# EAGLE design businesscard (EAGLE 9.2.1)
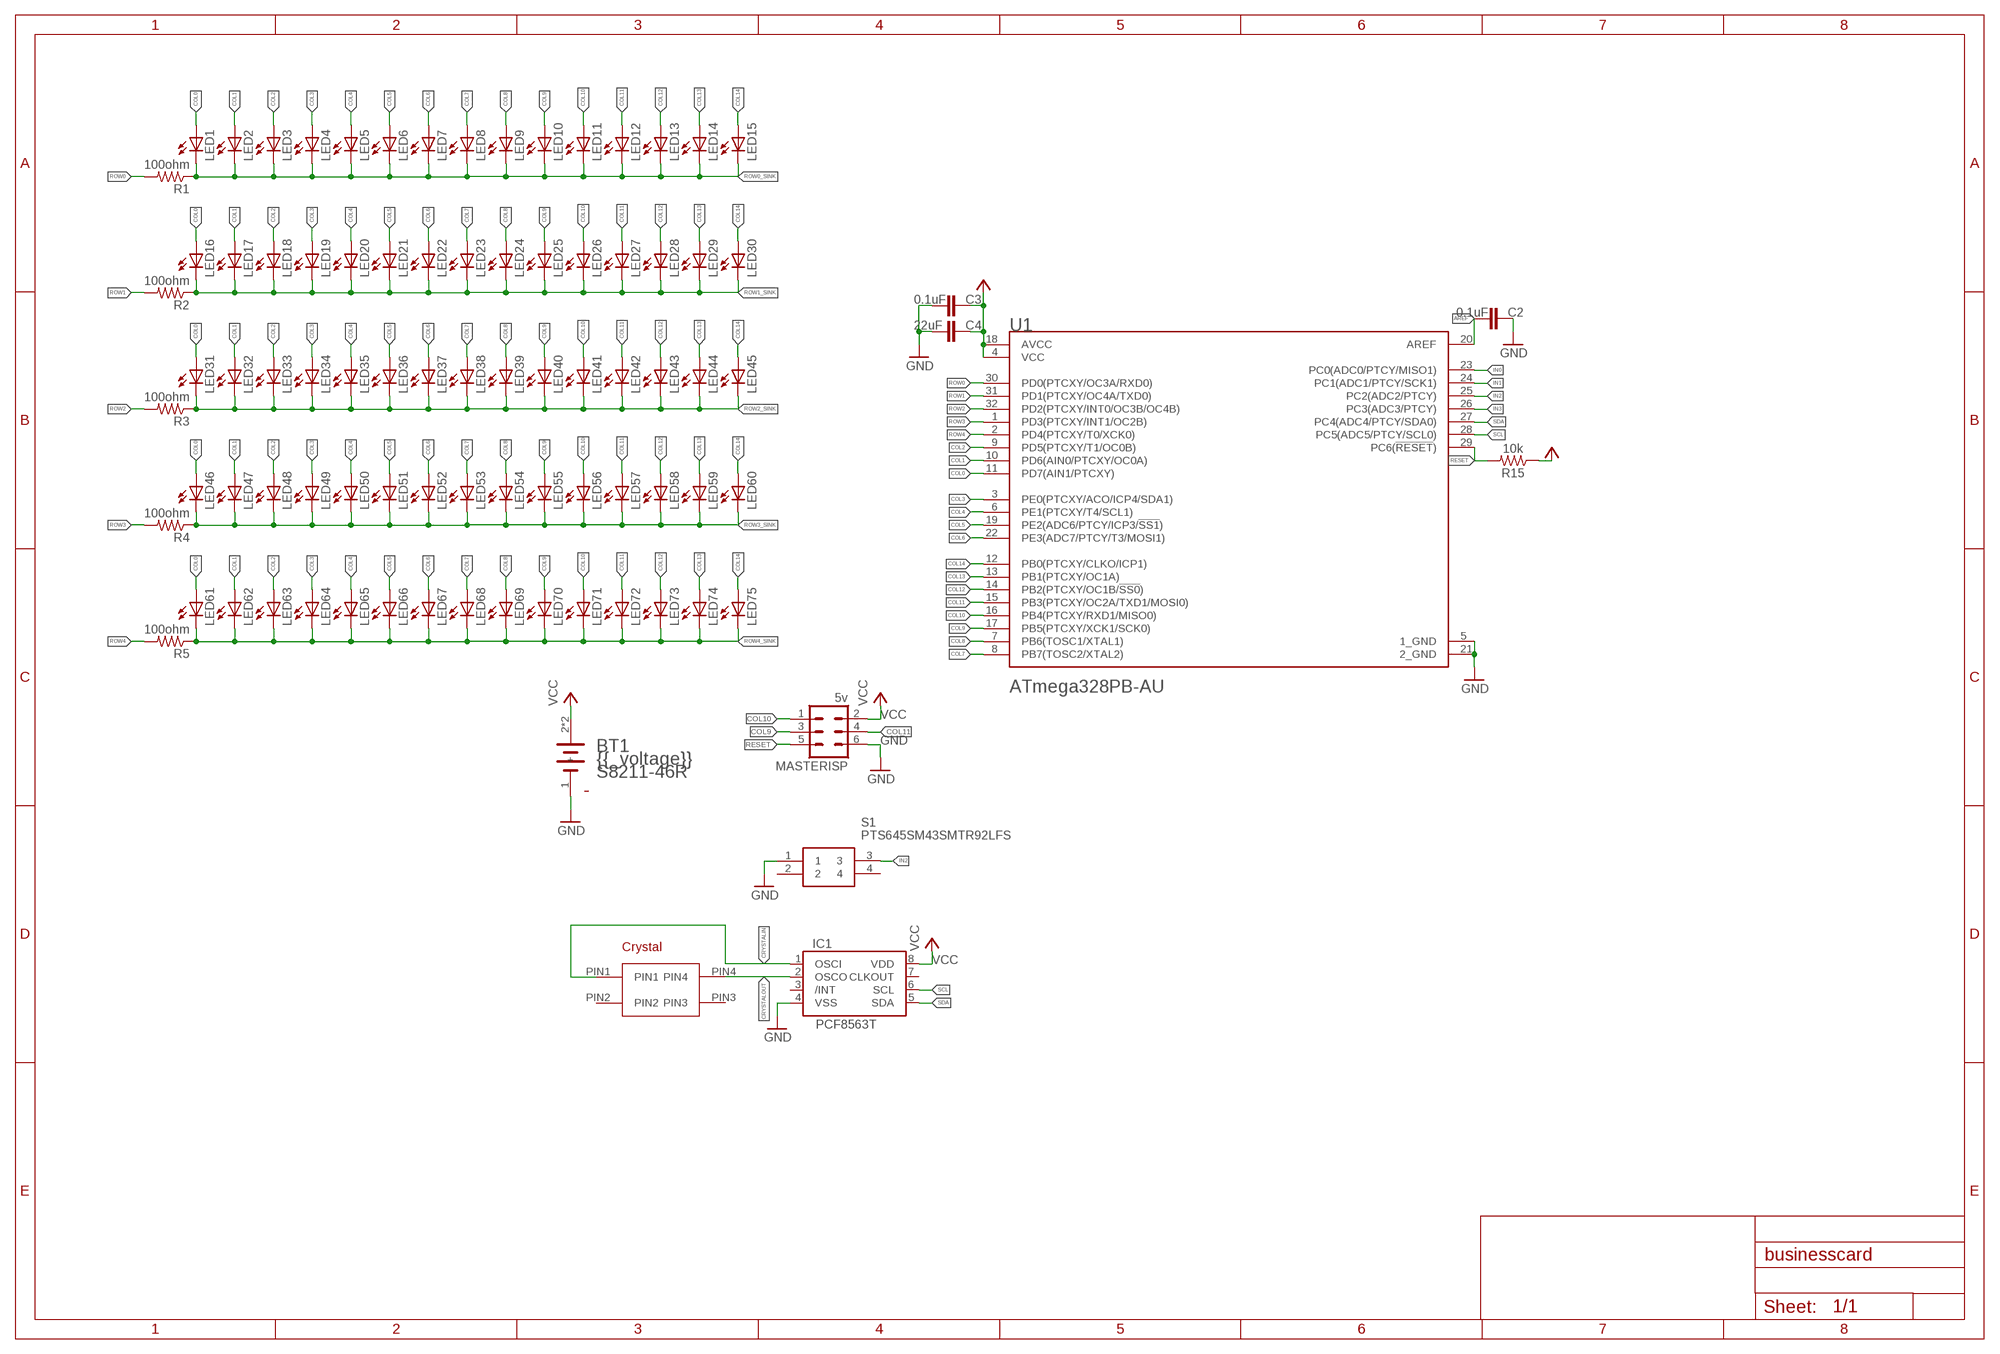
[diagram p0: schematic, sheet 1]

## Parts
BT1  3v  HARWIN_S8211-46RHARWIN_S8211-46R_0_0  [HARWIN_S8211-46R_0]
C2  0.1uF  C-EUC0603  [C0603]
C3  0.1uF  0.1UF-0603-25V-(+80/-20%)  [0603]
C4  22uF  C-EUC0603  [C0603]
IC1  PCF8563T  [SO8]
LED1  LEDCHIPLED_0805  [CHIPLED_0805]
LED2  LEDCHIPLED_0805  [CHIPLED_0805]
LED3  LEDCHIPLED_0805  [CHIPLED_0805]
LED4  LEDCHIPLED_0805  [CHIPLED_0805]
LED5  LEDCHIPLED_0805  [CHIPLED_0805]
LED6  LEDCHIPLED_0805  [CHIPLED_0805]
LED7  LEDCHIPLED_0805  [CHIPLED_0805]
LED8  LEDCHIPLED_0805  [CHIPLED_0805]
LED9  LEDCHIPLED_0805  [CHIPLED_0805]
LED10  LEDCHIPLED_0805  [CHIPLED_0805]
LED11  LEDCHIPLED_0805  [CHIPLED_0805]
LED12  LEDCHIPLED_0805  [CHIPLED_0805]
LED13  LEDCHIPLED_0805  [CHIPLED_0805]
LED14  LEDCHIPLED_0805  [CHIPLED_0805]
LED15  LEDCHIPLED_0805  [CHIPLED_0805]
LED16  LEDCHIPLED_0805  [CHIPLED_0805]
LED17  LEDCHIPLED_0805  [CHIPLED_0805]
LED18  LEDCHIPLED_0805  [CHIPLED_0805]
LED19  LEDCHIPLED_0805  [CHIPLED_0805]
LED20  LEDCHIPLED_0805  [CHIPLED_0805]
LED21  LEDCHIPLED_0805  [CHIPLED_0805]
LED22  LEDCHIPLED_0805  [CHIPLED_0805]
LED23  LEDCHIPLED_0805  [CHIPLED_0805]
LED24  LEDCHIPLED_0805  [CHIPLED_0805]
LED25  LEDCHIPLED_0805  [CHIPLED_0805]
LED26  LEDCHIPLED_0805  [CHIPLED_0805]
LED27  LEDCHIPLED_0805  [CHIPLED_0805]
LED28  LEDCHIPLED_0805  [CHIPLED_0805]
LED29  LEDCHIPLED_0805  [CHIPLED_0805]
LED30  LEDCHIPLED_0805  [CHIPLED_0805]
LED31  LEDCHIPLED_0805  [CHIPLED_0805]
LED32  LEDCHIPLED_0805  [CHIPLED_0805]
LED33  LEDCHIPLED_0805  [CHIPLED_0805]
LED34  LEDCHIPLED_0805  [CHIPLED_0805]
LED35  LEDCHIPLED_0805  [CHIPLED_0805]
LED36  LEDCHIPLED_0805  [CHIPLED_0805]
LED37  LEDCHIPLED_0805  [CHIPLED_0805]
LED38  LEDCHIPLED_0805  [CHIPLED_0805]
LED39  LEDCHIPLED_0805  [CHIPLED_0805]
LED40  LEDCHIPLED_0805  [CHIPLED_0805]
LED41  LEDCHIPLED_0805  [CHIPLED_0805]
LED42  LEDCHIPLED_0805  [CHIPLED_0805]
LED43  LEDCHIPLED_0805  [CHIPLED_0805]
LED44  LEDCHIPLED_0805  [CHIPLED_0805]
LED45  LEDCHIPLED_0805  [CHIPLED_0805]
LED46  LEDCHIPLED_0805  [CHIPLED_0805]
LED47  LEDCHIPLED_0805  [CHIPLED_0805]
LED48  LEDCHIPLED_0805  [CHIPLED_0805]
LED49  LEDCHIPLED_0805  [CHIPLED_0805]
LED50  LEDCHIPLED_0805  [CHIPLED_0805]
LED51  LEDCHIPLED_0805  [CHIPLED_0805]
LED52  LEDCHIPLED_0805  [CHIPLED_0805]
LED53  LEDCHIPLED_0805  [CHIPLED_0805]
LED54  LEDCHIPLED_0805  [CHIPLED_0805]
LED55  LEDCHIPLED_0805  [CHIPLED_0805]
LED56  LEDCHIPLED_0805  [CHIPLED_0805]
LED57  LEDCHIPLED_0805  [CHIPLED_0805]
LED58  LEDCHIPLED_0805  [CHIPLED_0805]
LED59  LEDCHIPLED_0805  [CHIPLED_0805]
LED60  LEDCHIPLED_0805  [CHIPLED_0805]
LED61  LEDCHIPLED_0805  [CHIPLED_0805]
LED62  LEDCHIPLED_0805  [CHIPLED_0805]
LED63  LEDCHIPLED_0805  [CHIPLED_0805]
LED64  LEDCHIPLED_0805  [CHIPLED_0805]
LED65  LEDCHIPLED_0805  [CHIPLED_0805]
LED66  LEDCHIPLED_0805  [CHIPLED_0805]
LED67  LEDCHIPLED_0805  [CHIPLED_0805]
LED68  LEDCHIPLED_0805  [CHIPLED_0805]
LED69  LEDCHIPLED_0805  [CHIPLED_0805]
LED70  LEDCHIPLED_0805  [CHIPLED_0805]
LED71  LEDCHIPLED_0805  [CHIPLED_0805]
LED72  LEDCHIPLED_0805  [CHIPLED_0805]
LED73  LEDCHIPLED_0805  [CHIPLED_0805]
LED74  LEDCHIPLED_0805  [CHIPLED_0805]
LED75  LEDCHIPLED_0805  [CHIPLED_0805]
MASTERISP  5v  MA03-2  [MA03-2]
R1  100ohm  R-US_R0603  [R0603]
R2  100ohm  R-US_R0603  [R0603]
R3  100ohm  R-US_R0603  [R0603]
R4  100ohm  R-US_R0603  [R0603]
R5  100ohm  R-US_R0603  [R0603]
R15  10k  10KOHM-0603-1/10W-1%  [0603]
S1  PTS645SM43SMTR92LFS  [PTS645(SMT)]
U1  MICROCHIP_ATMEGA328PB-AUMICROCHIP_ATMEGA328PB-AU_0_0  [MICROCHIP_ATMEGA328PB-AU_0]
U$1  32.768_SMD_CRYSTAL  [32.768_SMD_CRYSTAL]

## Nets
AREF: C2.2 U1.20(AREF)
COL0: LED1.A LED16.A LED31.A LED46.A LED61.A U1.11(PD7(AIN1/PTCXY))
COL1: LED2.A LED17.A LED32.A LED47.A LED62.A U1.10(PD6(AIN0/PTCXY/OC0A))
COL2: LED3.A LED18.A LED33.A LED48.A LED63.A U1.9(PD5(PTCXY/T1/OC0B))
COL3: LED4.A LED19.A LED34.A LED49.A LED64.A U1.3(PE0(PTCXY/ACO/ICP4/SDA1))
COL4: LED5.A LED20.A LED35.A LED50.A LED65.A U1.6(PE1(PTCXY/T4/SCL1))
COL5: LED6.A LED21.A LED36.A LED51.A LED66.A U1.19(PE2(ADC6/PTCY/ICP3/!SS1!))
COL6: LED7.A LED22.A LED37.A LED52.A LED67.A U1.22(PE3(ADC7/PTCY/T3/MOSI1))
COL7: LED8.A LED23.A LED38.A LED53.A LED68.A U1.8(PB7(TOSC2/XTAL2))
COL8: LED9.A LED24.A LED39.A LED54.A LED69.A U1.7(PB6(TOSC1/XTAL1))
COL9: LED10.A LED25.A LED40.A LED55.A LED70.A MASTERISP.3 U1.17(PB5(PTCXY/XCK1/SCK0))
COL10: LED11.A LED26.A LED41.A LED56.A LED71.A MASTERISP.1 U1.16(PB4(PTCXY/RXD1/MISO0))
COL11: LED12.A LED27.A LED42.A LED57.A LED72.A MASTERISP.4 U1.15(PB3(PTCXY/OC2A/TXD1/MOSI0))
COL12: LED13.A LED28.A LED43.A LED58.A LED73.A U1.14(PB2(PTCXY/OC1B/!SS0!))
COL13: LED14.A LED29.A LED44.A LED59.A LED74.A U1.13(PB1(PTCXY/OC1A))
COL14: LED15.A LED30.A LED45.A LED60.A LED75.A U1.12(PB0(PTCXY/CLKO/ICP1))
CRYSTALIN: IC1.1(OSCI) U$1.PIN1
CRYSTALOUT: IC1.2(OSCO) U$1.PIN4
GND: BT1.1(-) C2.1 C3.2 C4.2 IC1.4(VSS) MASTERISP.6 S1.1 U1.5(1_GND) U1.21(2_GND)
IN0: U1.23(PC0(ADC0/PTCY/MISO1))
IN1: U1.24(PC1(ADC1/PTCY/SCK1))
IN2: S1.3 U1.25(PC2(ADC2/PTCY))
IN3: U1.26(PC3(ADC3/PTCY))
RESET: MASTERISP.5 R15.2 U1.29(PC6(!RESET!))
ROW0: R1.2 U1.30(PD0(PTCXY/OC3A/RXD0))
ROW0_SINK: LED1.C LED2.C LED3.C LED4.C LED5.C LED6.C LED7.C LED8.C LED9.C LED10.C LED11.C LED12.C LED13.C LED14.C LED15.C R1.1
ROW1: R2.2 U1.31(PD1(PTCXY/OC4A/TXD0))
ROW1_SINK: LED16.C LED17.C LED18.C LED19.C LED20.C LED21.C LED22.C LED23.C LED24.C LED25.C LED26.C LED27.C LED28.C LED29.C LED30.C R2.1
ROW2: R3.2 U1.32(PD2(PTCXY/INT0/OC3B/OC4B))
ROW2_SINK: LED31.C LED32.C LED33.C LED34.C LED35.C LED36.C LED37.C LED38.C LED39.C LED40.C LED41.C LED42.C LED43.C LED44.C LED45.C R3.1
ROW3: R4.2 U1.1(PD3(PTCXY/INT1/OC2B))
ROW3_SINK: LED46.C LED47.C LED48.C LED49.C LED50.C LED51.C LED52.C LED53.C LED54.C LED55.C LED56.C LED57.C LED58.C LED59.C LED60.C R4.1
ROW4: R5.2 U1.2(PD4(PTCXY/T0/XCK0))
ROW4_SINK: LED61.C LED62.C LED63.C LED64.C LED65.C LED66.C LED67.C LED68.C LED69.C LED70.C LED71.C LED72.C LED73.C LED74.C LED75.C R5.1
SCL: IC1.6(SCL) U1.28(PC5(ADC5/PTCY/SCL0))
SDA: IC1.5(SDA) U1.27(PC4(ADC4/PTCY/SDA0))
VCC: BT1.2(+) BT1.2-2(+) C3.1 C4.1 IC1.8(VDD) MASTERISP.2 R15.1 U1.4(VCC) U1.18(AVCC)
Unconnected: IC1.3(/INT) IC1.7(CLKOUT) S1.2 S1.4 U$1.PIN2 U$1.PIN3

## Library data of the parts
BT1 = Harwin - S8211-46R:HARWIN_S8211-46R: HOLDER BATT COIN CR2032/20MM; CENTROID_NOT_SPECIFIED: No; DATASHEET: https://cdn.harwin.com/pdfs/S8211R.pdf; DIGIKEY_DESCRIPTION: BATT HOLDER BATT COIN CR2032/20MM; DIGIKEY_PART_NUMBER: 952-1735-1-ND; LEAD_FREE: yes; MF: Harwin; MOUSER_PART_NUMBER: 855-S8211-46R; MPN: S8211-46R; PACKAGE: BAT_HOLDER_SMT; PREFIX: BT; ROHS: yes; TEMPERATURE_RANGE_HIGH: +105°C; TEMPERATURE_RANGE_LOW: -40°C
C2 C4 = rcl:C-EU: CAPACITOR, European symbol; SPICEPREFIX: C
C3 = SparkFun-Capacitors:0.1UF: 0.1µF ceramic capacitors A capacitor is a passive two-terminal electrical component used to store electrical energy temporarily in an electric field.; PROD_ID: CAP-00810
IC1 = PCF8563T:PCF8563
LED1-LED75 = adafruit:LED: LED OSRAM: - CHIPLED LG R971, LG N971, LY N971, LG Q971, LY Q971, LO R971, LY R971 LH N974, LH R974 LS Q976, LO Q976, LY Q976 LO Q996 - Hyper CHIPLED LW Q18S LB Q993, LB Q99A, LB R99A - SideLED LS A670, LO A670, LY A670, LG A670, LP A670 LB A673, LV A673, LT A673, LW A673 LH A674 LY A675 LS A676, LA A676, LO A676, LY A676, LW A676 LS A679, LY A679, LG A679 - Hyper Micro SIDELED® LS Y876, LA Y876, LO Y876, LY Y876 LT Y87S - SmartLED LW L88C, LW L88S LB L89C, LB L89S, LG L890 LS L89K, LO L89K, LY L89K LS L896, LA L896, LO L896, LY L896 - TOPLED LS T670, LO T670, LY T670, LG T670, LP T670 LSG T670, LSP T670, LSY T670, LOP T670, LYG T670 LG T671, LOG T671, LSG T671 LB T673, LV T673, LT T673, LW T673 LH T674 LS T676, LA T676, LO T676, LY T676, LB T676, LH T676, LSB T676, LW T676 LB T67C, LV T67C, LT T67C, LS T67K, LO T67K, LY T67K, LW E67C LS E67B, LA E67B, LO E67B, LY E67B, LB E67C, LV E67C, LT E67C LW T67C LS T679, LY T679, LG T679 LS T770, LO T770, LY T770, LG T770, LP T770 LB T773, LV T773, LT T773, LW T773 LH T774 LS E675, LA E675, LY E675, LS T675 LS T776, LA T776, LO T776, LY T776, LB T776 LHGB T686 LT T68C, LB T68C - Hyper Mini TOPLED® LB M676 - Mini TOPLED Santana® LG M470 LS M47K, LO M47K, LY M47K Source: http://www.osram.convergy.de/
MASTERISP = con-lstb:MA03-2: PIN HEADER; OC_FARNELL: unknown; OC_NEWARK: unknown
R1-R5 = adafruit:R-US_: RESISTOR, American symbol
R15 = SparkFun-Resistors:10KOHM: 10kΩ resistor A resistor is a passive two-terminal electrical component that implements electrical resistance as a circuit element. Resistors act to reduce current flow, and, at the same time, act to lower voltage levels within circuits. - Wikipedia; PROD_ID: RES-00824
S1 = PTS645SM43SMTR92LFS:PTS645SM43SMTR92LFS: C & K COMPONENTS - PTS645SM43SMTR92LFS - SWITCH, SPST, 0.05A, 12VDC, SMD, 4.3MM Source: Datasheet <http://www.farnell.com/datasheets/1914518.pdf>; DESCRIPTION: C & K COMPONENTS - PTS645SM43SMTR92LFS - SWITCH, SPST, 0.05A, 12VDC, SMD, 4.3MM; HEIGHT: mm; MANUFACTURER_NAME: C & K COMPONENTS; MANUFACTURER_PART_NUMBER: PTS645SM43SMTR92LFS; MOUSER_PART_NUMBER: 611-PTS645SM43SMTR92; MOUSER_PRICE-STOCK: https://www.mouser.com/Search/Refine.aspx?Keyword=611-PTS645SM43SMTR92
U1 = Microchip - ATmega328PB-AU:MICROCHIP_ATMEGA328PB-AU: ATmega328PB Summary Datasheet; CENTROID_NOT_SPECIFIED: No; DATASHEET: http://ww1.microchip.com/downloads/en/DeviceDoc/40001907A.pdf; DIGIKEY_DESCRIPTION: IC MCU 8BIT 32KB FLASH 32TQFP; DIGIKEY_PART_NUMBER: ATMEGA328PB-AU-ND; LEAD_FREE: yes; MF: Microchip; MFG_PACKAGE_IDENT: 32A; MOUSER_PART_NUMBER: 556-ATMEGA328PB-AU; MPN: ATmega328PB-AU; PACKAGE: TQFP32; PREFIX: U; ROHS: yes; TEMPERATURE_RANGE_HIGH: +85°C; TEMPERATURE_RANGE_LOW: -40°C; VOLTAGE: 5.5V
U$1 = 32.768-crystal:32.768_SMD_CRYSTAL

## Board
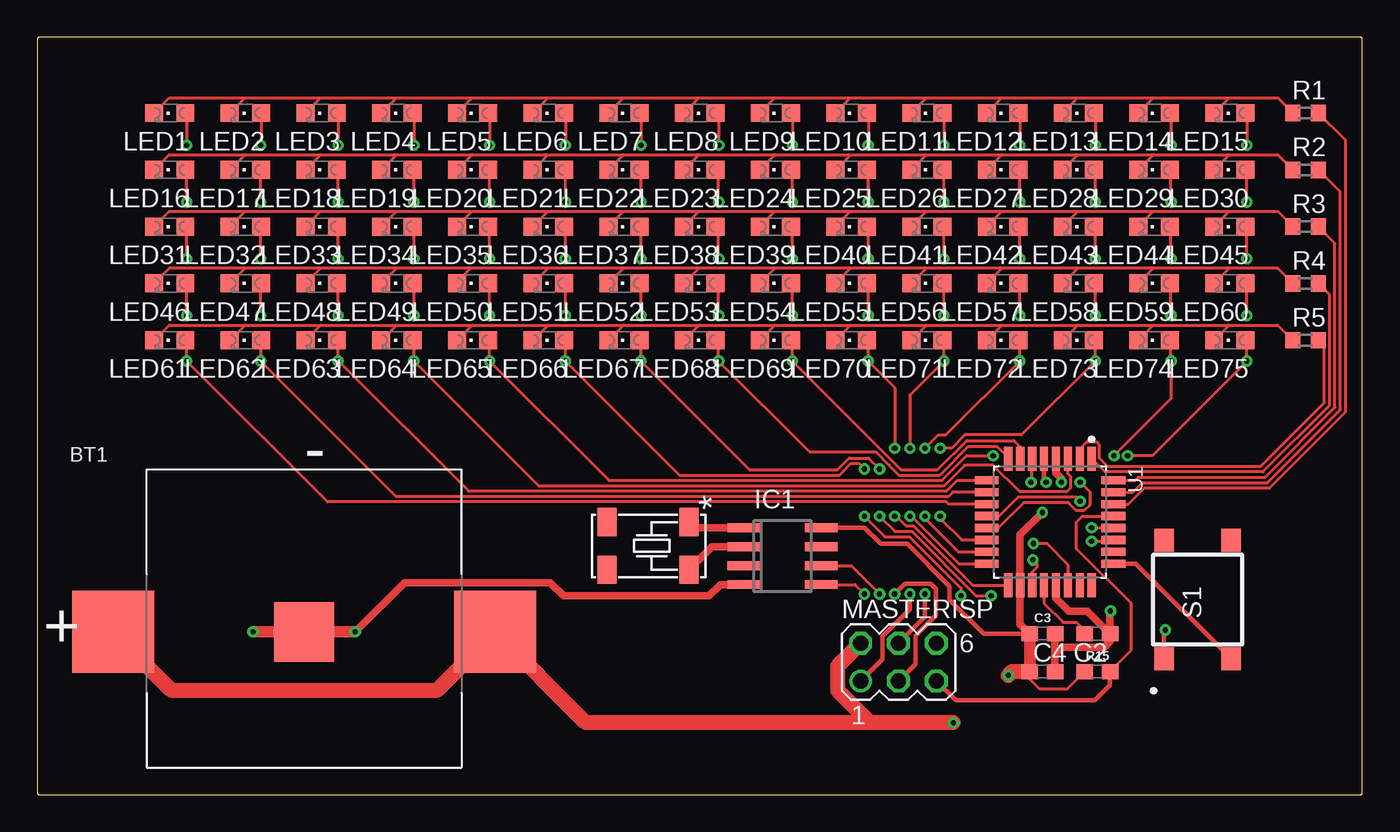
[diagram p1: board, top side]
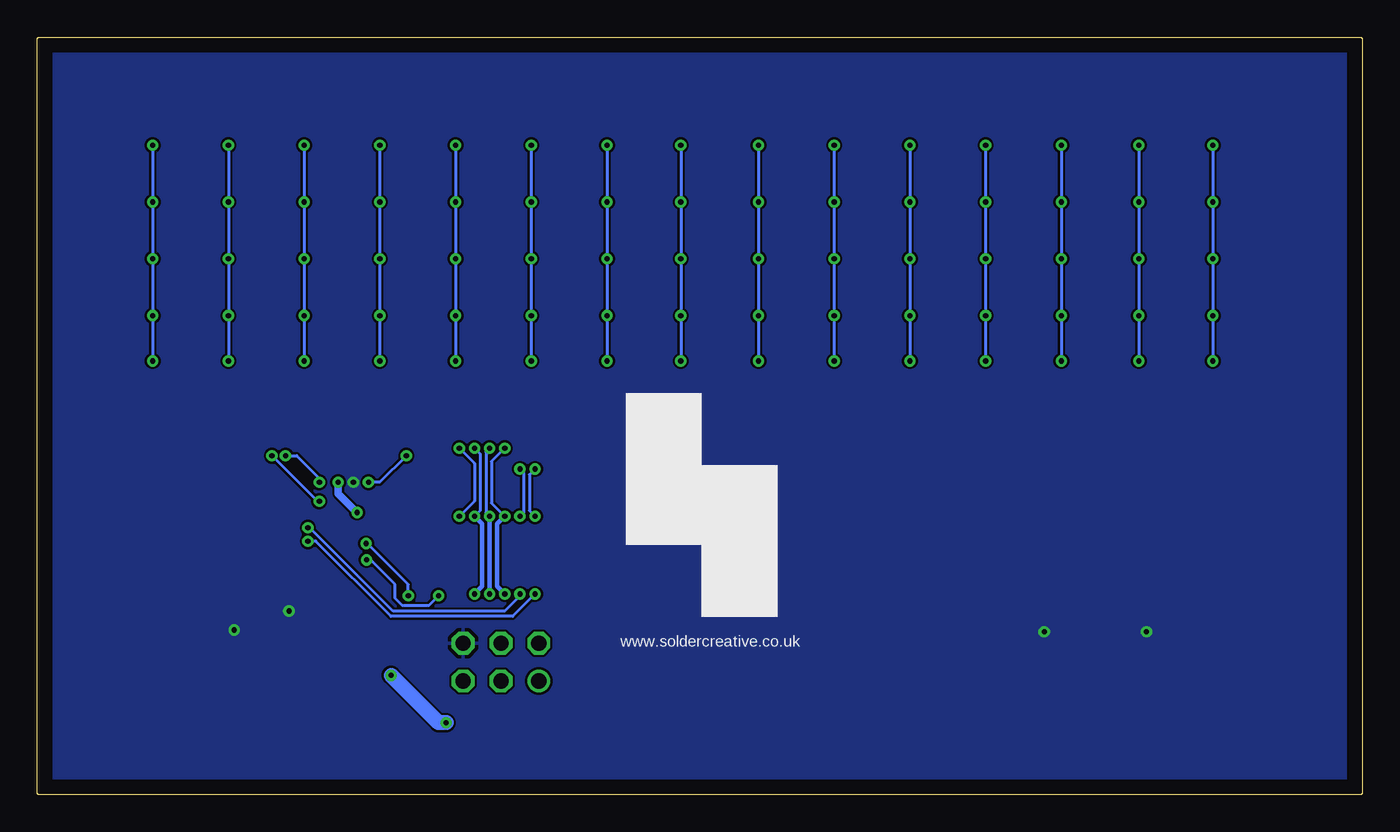
[diagram p2: board, bottom side, seen from below]

Size 88.9 x 50.8 mm. Coordinates in mm from the lower left corner, seen from the top.
Outline: 0,50.67 0,0.13 arc90 0.13,0 88.77,0 arc90 88.9,0.13 88.9,50.67 arc90 88.77,50.8 0.13,50.8 arc90 0,50.67
Copper layers (1*16): Top 0.035mm / dielectric 1.5mm / Bottom 0.035mm
Design rules "default": minimum track width 6mil, minimum drill 0.35mm, track to track 6mil, track to pad 6mil, pad to pad 6mil, via to via 6mil, smd to smd 6mil, copper to edge 40mil, drill to drill 6mil, minimum pad ring 10mil, minimum via ring 8mil, stop-mask expansion 4mil, vias tented up to drill 0mil, thermal gap 10mil

### Footprints (pad centres in the part's own frame; a part is rotated, then mirrored left to right if it is on the bottom)
HARWIN_S8211-46R_0 = smd 4 x 4: 1 0,-0.9 | smd 5.5 x 5.5: 2 -12.8,-0.9; 2-2 12.8,-0.9
C0603 = smd 1.1 x 1: 1 -0.85,0; 2 0.85,0
0603 = smd 1.1 x 1: 1 -0.85,0; 2 0.85,0
SO8 = smd 0.6 x 2.2: 1 -1.905,-2.6; 2 -0.635,-2.6; 3 0.635,-2.6; 4 1.905,-2.6; 5 1.905,2.6; 6 0.635,2.6; 7 -0.635,2.6; 8 -1.905,2.6
CHIPLED_0805 = smd 1.2 x 1.2: A 0,-1.05; C 0,1.05
MA03-2 = drill 1.016: 1 -2.54,-1.27 | drill 1.016 octagon: 2 -2.54,1.27; 3 0,-1.27; 4 0,1.27; 5 2.54,-1.27; 6 2.54,1.27
R0603 = smd 1 x 1.1: 1 -0.85,0; 2 0.85,0
PTS645(SMT) = smd 1.55 x 1.3: 1 -3.975,2.25; 2 3.975,2.25; 3 -3.975,-2.25; 4 3.975,-2.25
MICROCHIP_ATMEGA328PB-AU_0 = smd 1.6 x 0.55: 1 -4.25,2.8; 2 -4.25,2; 3 -4.25,1.2; 4 -4.25,0.4; 5 -4.25,-0.4; 6 -4.25,-1.2; 7 -4.25,-2; 8 -4.25,-2.8; 17 4.25,-2.8; 18 4.25,-2; 19 4.25,-1.2; 20 4.25,-0.4; 21 4.25,0.4; 22 4.25,1.2; 23 4.25,2; 24 4.25,2.8 | smd 0.55 x 1.6: 9 -2.8,-4.25; 10 -2,-4.25; 11 -1.2,-4.25; 12 -0.4,-4.25; 13 0.4,-4.25; 14 1.2,-4.25; 15 2,-4.25; 16 2.8,-4.25; 25 2.8,4.25; 26 2,4.25; 27 1.2,4.25; 28 0.4,4.25; 29 -0.4,4.25; 30 -1.2,4.25; 31 -2,4.25; 32 -2.8,4.25
32.768_SMD_CRYSTAL = smd 1.9 x 1.3: PIN1 0,5.5; PIN2 0,0; PIN3 3.2,0; PIN4 3.2,5.5

### Placement (x,y rotation side)
BT1  17.91,11.81 0 top
C2  71.12,10.79 180 top
C3  67.44,10.79 0 top
C4  67.44,8.26 0 top
IC1  50,16 270 top
LED1  8.89,45.72 90 top
LED2  13.97,45.72 90 top
LED3  19.05,45.72 90 top
LED4  24.13,45.72 90 top
LED5  29.21,45.72 90 top
LED6  34.29,45.72 90 top
LED7  39.37,45.72 90 top
LED8  44.45,45.72 90 top
LED9  49.53,45.72 90 top
LED10  54.61,45.72 90 top
LED11  59.69,45.72 90 top
LED12  64.77,45.72 90 top
LED13  69.85,45.72 90 top
LED14  74.93,45.72 90 top
LED15  80.01,45.72 90 top
LED16  8.89,41.91 90 top
LED17  13.97,41.91 90 top
LED18  19.05,41.91 90 top
LED19  24.13,41.91 90 top
LED20  29.21,41.91 90 top
LED21  34.29,41.91 90 top
LED22  39.37,41.91 90 top
LED23  44.45,41.91 90 top
LED24  49.53,41.91 90 top
LED25  54.61,41.91 90 top
LED26  59.69,41.91 90 top
LED27  64.77,41.91 90 top
LED28  69.85,41.91 90 top
LED29  74.93,41.91 90 top
LED30  80.01,41.91 90 top
LED31  8.89,38.1 90 top
LED32  13.97,38.1 90 top
LED33  19.05,38.1 90 top
LED34  24.13,38.1 90 top
LED35  29.21,38.1 90 top
LED36  34.29,38.1 90 top
LED37  39.37,38.1 90 top
LED38  44.45,38.1 90 top
LED39  49.53,38.1 90 top
LED40  54.61,38.1 90 top
LED41  59.69,38.1 90 top
LED42  64.77,38.1 90 top
LED43  69.85,38.1 90 top
LED44  74.93,38.1 90 top
LED45  80.01,38.1 90 top
LED46  8.89,34.29 90 top
LED47  13.97,34.29 90 top
LED48  19.05,34.29 90 top
LED49  24.13,34.29 90 top
LED50  29.21,34.29 90 top
LED51  34.29,34.29 90 top
LED52  39.37,34.29 90 top
LED53  44.45,34.29 90 top
LED54  49.53,34.29 90 top
LED55  54.61,34.29 90 top
LED56  59.69,34.29 90 top
LED57  64.77,34.29 90 top
LED58  69.85,34.29 90 top
LED59  74.93,34.29 90 top
LED60  80.01,34.29 90 top
LED61  8.89,30.48 90 top
LED62  13.97,30.48 90 top
LED63  19.05,30.48 90 top
LED64  24.13,30.48 90 top
LED65  29.21,30.48 90 top
LED66  34.29,30.48 90 top
LED67  39.37,30.48 90 top
LED68  44.45,30.48 90 top
LED69  49.53,30.48 90 top
LED70  54.61,30.48 90 top
LED71  59.69,30.48 90 top
LED72  64.77,30.48 90 top
LED73  69.85,30.48 90 top
LED74  74.93,30.48 90 top
LED75  80.01,30.48 90 top
MASTERISP  57.78,8.89 0 top
R1  85.09,45.72 0 top
R2  85.09,41.91 0 top
R3  85.09,38.1 0 top
R4  85.09,34.29 0 top
R5  85.09,30.48 0 top
R15  71.12,8.26 0 top
S1  77.85,13.08 90 top
U1  67.94,18.29 270 top
U$1  38.23,18.29 270 top

### Tracks (layer width: path | path; a pad name or v marks a point on that pad's centre or on a via)
AREF
  Top 0.203: U1.20 67.55,12.85 68.83,11.56 69.72,11.56 70.27,11.01 C2.2
COL0  (via drill 0.35)
  Top 0.203: LED1.A 10.03,45.63 v10.03,43.56 | v10.03,39.75 10.03,41.82 LED16.A | v10.03,35.94 10.03,38.01 LED31.A | v10.03,32.13 10.03,34.2 LED46.A | LED61.A 10.03,30.39 v10.03,29.08 19.48,19.63 61.01,19.63 61.16,19.49 U1.11
  Bottom 0.203: v10.03,43.56 v10.03,39.75 v10.03,35.94 v10.03,32.13 v10.03,29.08
COL1  (via drill 0.35)
  Top 0.203: LED2.A 15.02,43.59 v14.99,43.56 | v14.99,39.75 14.99,41.88 LED17.A | v14.99,35.94 14.99,38.07 LED32.A | v14.99,32.13 14.99,34.26 LED47.A | LED62.A 15.02,29.12 v14.99,29.08 24.08,19.99 61.13,19.99 61.43,20.29 U1.10
  Bottom 0.203: v14.99,43.56 v14.99,39.75 v14.99,35.94 v14.99,32.13 v14.99,29.08
COL2  (via drill 0.35)
  Top 0.203: LED3.A 20.19,45.63 v20.19,43.56 | v20.19,39.75 20.19,41.82 LED18.A | v20.19,35.94 20.19,38.01 LED33.A | v20.19,32.13 20.19,34.2 LED48.A | LED63.A 20.19,30.39 v20.19,29.08 20.23,29.08 28.97,20.34 60.98,20.34 61.72,21.08 U1.9
  Bottom 0.203: v20.19,43.56 v20.19,39.75 v20.19,35.94 v20.19,32.13 v20.19,29.08
COL3  (via drill 0.35)
  Top 0.203: LED4.A 25.27,45.63 v25.27,43.56 | v25.27,39.75 25.27,41.82 LED19.A | v25.27,35.94 25.27,38.01 LED34.A | v25.27,32.13 25.27,34.2 LED49.A | LED64.A 25.27,30.39 v25.27,29.08 33.66,20.7 60.83,20.7 62.23,22.1 64.14,22.1 65.91,20.32 69.09,20.32 69.34,20.57 69.34,21.34 69.14,21.53 U1.3
  Bottom 0.203: v25.27,43.56 v25.27,39.75 v25.27,35.94 v25.27,32.13 v25.27,29.08
COL4  (via drill 0.35)
  Top 0.203: LED5.A 30.35,45.63 v30.35,43.56 | v30.35,39.75 30.35,41.82 LED20.A | v30.35,35.94 30.35,38.01 LED35.A | v30.35,32.13 30.35,34.2 LED50.A | LED65.A 30.35,30.39 v30.35,29.08 38.35,21.08 60.71,21.08 62.36,22.73 v64.14,22.73 | v66.67,20.95 66.75,21.02 U1.6
  Bottom 0.203: v30.35,43.56 v30.35,39.75 v30.35,35.94 v30.35,32.13 v30.35,29.08 | v64.14,22.73 65.91,20.95 v66.67,20.95
COL5  (via drill 0.35)
  Top 0.203: LED6.A 35.43,45.63 v35.43,43.56 | v35.43,39.75 35.43,41.82 LED21.A | v35.43,35.94 35.43,38.01 LED36.A | v35.43,32.13 35.43,34.2 LED51.A | LED66.A 35.43,30.39 v35.43,29.08 43.08,21.44 53.82,21.44 54.61,22.23 55.12,22.23 v55.5,21.84 | v55.5,18.67 56.87,17.3 58.53,17.3 61.98,13.85 v61.98,13.34 | v66.8,15.75 67.06,15.49 67.06,15.24 66.75,14.93 U1.19
  Bottom 0.203: v35.43,43.56 v35.43,39.75 v35.43,35.94 v35.43,32.13 v35.43,29.08 | v55.5,21.84 55.88,21.46 55.88,19.05 v55.5,18.67 | v61.98,13.34 62.64,12.68 64.39,12.68 64.9,13.18 64.9,14.1 66.55,15.75 v66.8,15.75
COL6  (via drill 0.35)
  Top 0.203: LED7.A 40.51,45.63 v40.51,43.56 | v40.51,39.75 40.51,41.82 LED22.A | v40.51,35.94 40.51,38.01 LED37.A | v40.51,32.13 40.51,34.2 LED52.A | LED67.A 40.51,30.39 v40.51,29.08 47.8,21.79 53.67,21.79 54.46,22.58 55.78,22.58 v56.52,21.84 | v64.01,13.34 62.99,13.34 58.67,17.65 57.53,17.65 v56.52,18.67 | v66.84,16.85 67.73,16.85 69.14,15.44 U1.22
  Bottom 0.203: v40.51,43.56 v40.51,39.75 v40.51,35.94 v40.51,32.13 v40.51,29.08 | v56.52,21.84 56.26,21.59 56.26,18.92 v56.52,18.67 | v66.84,16.85 66.76,16.85 64.01,14.1 v64.01,13.34
COL7  (via drill 0.35)
  Top 0.203: LED8.A 45.72,45.5 v45.72,43.56 | v45.72,39.75 45.72,41.69 LED23.A | v45.72,35.94 45.72,37.88 LED38.A | v45.72,32.13 45.72,34.07 LED53.A | LED68.A 45.72,30.26 v45.72,29.08 51.82,22.99 56.27,22.99 57.15,22.11 57.15,22.1 57.81,21.44 60.56,21.44 62.49,23.36 64.4,23.36 65.14,22.62 U1.8
  Bottom 0.203: v45.72,43.56 v45.72,39.75 v45.72,35.94 v45.72,32.13 v45.72,29.08
COL8  (via drill 0.35)
  Top 0.203: LED9.A 50.67,45.63 v50.67,43.56 | v50.67,39.75 50.67,41.82 LED24.A | v50.67,35.94 50.67,38.01 LED39.A | v50.67,32.13 50.67,34.2 LED54.A | LED69.A 50.67,30.39 v50.67,29.08 57.96,21.79 60.41,21.79 62.37,23.75 65.53,23.75 65.94,23.34 U1.7
  Bottom 0.203: v50.67,43.56 v50.67,39.75 v50.67,35.94 v50.67,32.13 v50.67,29.08
COL9  (via drill 0.35)
  Top 0.203: LED10.A 55.75,45.63 v55.75,43.56 | v55.75,39.75 55.75,41.82 LED25.A | v55.75,35.94 55.75,38.01 LED40.A | v55.75,32.13 55.75,34.2 LED55.A | LED70.A 55.75,30.39 v55.75,29.08 57.53,27.3 v57.53,23.24 | U1.17 62.79,14.04 58.79,18.04 58.28,18.04 57.65,18.67 v57.53,18.67
  Top 0.305: v57.53,13.46 58.21,14.14 59.96,14.14 60.29,13.81 60.29,12.02 58.93,10.66 58.93,8.76 MASTERISP.3
  Bottom 0.203: v55.75,43.56 v55.75,39.75 v55.75,35.94 v55.75,32.13 v55.75,29.08 | v57.53,23.24 58.42,22.35 58.42,19.56 v57.53,18.67
  Bottom 0.305: v57.53,18.67 58.04,18.16 58.04,13.97 v57.53,13.46
COL10  (via drill 0.35)
  Top 0.203: LED11.A 60.83,45.63 v60.83,43.56 | v60.83,39.75 60.83,41.82 LED26.A | v60.83,35.94 60.83,38.01 LED41.A | v60.83,32.13 60.83,34.2 LED56.A | LED71.A 60.83,30.39 v60.83,29.08 58.55,26.8 v58.55,23.24 | U1.16 61.84,15.49 58.66,18.67 v58.55,18.67
  Top 0.305: v58.55,13.46 58.55,12.45 56.72,10.62 56.72,9.09 MASTERISP.1
  Bottom 0.203: v60.83,43.56 v60.83,39.75 v60.83,35.94 v60.83,32.13 v60.83,29.08 | v58.55,23.24 58.8,22.99 58.8,18.92 v58.55,18.67
  Bottom 0.305: v58.55,18.67 v58.55,13.46
COL11  (via drill 0.35)
  Top 0.203: LED12.A 65.91,45.63 v65.91,43.56 | v65.91,39.75 65.91,41.82 LED27.A | v65.91,35.94 65.91,38.01 LED42.A | v65.91,32.13 65.91,34.2 LED57.A | LED72.A 65.91,30.39 v65.91,29.08 60.96,24.13 60.45,24.13 v59.56,23.24 | v59.56,18.67 59.56,18.54 61.82,16.29 U1.15
  Top 0.305: v59.56,13.46 59.56,11.94 MASTERISP.4
  Bottom 0.203: v65.91,43.56 v65.91,39.75 v65.91,35.94 v65.91,32.13 v65.91,29.08 | v59.56,23.24 59.18,22.86 59.18,19.05 v59.56,18.67
  Bottom 0.305: v59.56,18.67 59.05,18.16 59.05,13.97 v59.56,13.46
COL12  (via drill 0.35)
  Top 0.203: LED13.A 70.99,45.63 v70.99,43.56 | v70.99,39.75 70.99,41.82 LED28.A | v70.99,35.94 70.99,38.01 LED43.A | v70.99,32.13 70.99,34.2 LED58.A | LED73.A 70.99,30.39 v70.99,29.08 66.04,24.13 62.24,24.13 61.36,23.24 v60.58,23.24 | v60.58,18.67 60.58,18.54 62.03,17.09 U1.14
  Bottom 0.203: v70.99,43.56 v70.99,39.75 v70.99,35.94 v70.99,32.13 v70.99,29.08 | v60.58,23.24 59.56,22.23 59.56,19.68 v60.58,18.67
COL13  (via drill 0.35)
  Top 0.203: LED14.A 76.07,45.63 v76.07,43.56 | v76.07,39.75 76.07,41.82 LED29.A | v76.07,35.94 76.07,38.01 LED44.A | v76.07,32.13 76.07,34.2 LED59.A | LED74.A 76.07,30.39 v76.07,29.08 76.07,26.56 v72.24,22.73 | U1.13 64.5,17.89 66.19,19.58 69.19,19.58 69.72,19.05 70.23,19.05 70.24,19.05 70.61,19.43 70.61,20.32 v69.98,20.95
  Bottom 0.203: v76.07,43.56 v76.07,39.75 v76.07,35.94 v76.07,32.13 v76.07,29.08 | v72.24,22.73 71.48,22.73 69.98,21.23 v69.98,20.95
COL14  (via drill 0.35)
  Top 0.203: LED15.A 81.15,45.63 v81.15,43.56 | v81.15,39.75 81.15,41.82 LED30.A | v81.15,35.94 81.15,38.01 LED45.A | v81.15,32.13 81.15,34.2 LED60.A | LED75.A 81.15,30.39 v81.15,29.08 74.8,22.73 v73.15,22.73 | v69.98,19.68 69.72,19.94 65.79,19.94 64.52,18.67 63.71,18.67 U1.12
  Bottom 0.203: v81.15,43.56 v81.15,39.75 v81.15,35.94 v81.15,32.13 v81.15,29.08 | v73.15,22.73 70.1,19.68 v69.98,19.68
CRYSTALIN
  Top 0.508: IC1.1 44.11,17.91 U$1.PIN1
CRYSTALOUT
  Top 0.508: IC1.2 45.27,16.64 U$1.PIN4
GND  (via drill 0.35)
  Top 0.305: U1.5 67.55,21.1 v67.69,20.95 | S1.1 75.6,10.96 v75.69,11.05
  Top 0.508: U1.21 68.34,13.18 69.21,12.32 70.45,12.32 C2.1 | C2.1 71.97,12.28 v72.01,12.32 | C3.2 68.29,9.4 | 68.29,9.4 C4.2 | C2.1 71.97,10.25 71.61,9.89 68.78,9.89 68.29,9.4 | IC1.4 45.84,14.1 45.09,13.34 35.31,13.34 34.42,14.22 24.64,14.22 21.32,10.91
  Top 0.762: v21.34,10.92 21.32,10.91 BT1.1 v14.49,10.91 v14.48,10.92
  pour Bottom: -1.27,52.07 90.17,52.07 90.17,-1.27 -1.27,-1.27
IN2
  Top 0.305: S1.3 73.72,15.49 U1.25
RESET
  Top 0.203: R15.2 73.41,9.69 73.41,12.83 69.72,16.51 69.72,18.29 70.12,18.69 U1.29
  Top 0.305: MASTERISP.5 61.62,6.33 70.97,6.33 71.97,7.33 R15.2
ROW0
  Top 0.203: R1.2 87.78,43.88 87.78,25.68 82.69,20.58 74.3,20.58 73.21,19.49 U1.30
ROW0_SINK
  Top 0.203: LED2.C 13.94,46.74 | R1.1 83.22,46.74 79.98,46.74 | 13.94,46.74 19.02,46.74 | 19.02,46.74 24.1,46.74 | 24.1,46.74 29.08,46.74 | 29.08,46.74 34.26,46.74 | 34.26,46.74 39.34,46.74 | 39.34,46.74 44.42,46.74 | 44.42,46.74 49.5,46.74 | 49.5,46.74 54.58,46.74 | 54.58,46.74 59.56,46.74 | 59.56,46.74 64.74,46.74 | 64.74,46.74 69.82,46.74 | 69.82,46.74 74.9,46.74 | 74.9,46.74 79.98,46.74 | LED15.C 79.98,46.74 | LED14.C 74.9,46.74 | LED13.C 69.82,46.74 | LED12.C 64.74,46.74 | LED11.C 59.56,46.64 59.56,46.74 | LED10.C 54.58,46.74 | LED9.C 49.5,46.74 | LED8.C 44.42,46.74 | LED7.C 39.34,46.74 | LED6.C 34.26,46.74 | LED5.C 29.08,46.64 29.08,46.74 | LED4.C 24.1,46.74 | LED3.C 19.02,46.74 | LED1.C 8.86,46.74 13.94,46.74
ROW1
  Top 0.203: R2.2 87.43,40.42 87.43,25.83 82.54,20.94 74.15,20.94 73.5,20.29 U1.31
ROW1_SINK
  Top 0.203: LED16.C 8.86,42.93 13.94,42.93 | R2.1 83.22,42.93 79.98,42.93 | 13.94,42.93 19.02,42.93 | 19.02,42.93 24.1,42.93 | 24.1,42.93 29.18,42.93 | 29.18,42.93 34.16,42.93 | 34.16,42.93 39.34,42.93 | 39.34,42.93 44.42,42.93 | 44.42,42.93 49.5,42.93 | 49.5,42.93 54.48,42.93 | 54.48,42.93 59.66,42.93 | 59.66,42.93 64.74,42.93 | 64.74,42.93 69.72,42.93 | 69.72,42.93 74.9,42.93 | 74.9,42.93 79.98,42.93 | LED30.C 79.98,42.93 | LED29.C 74.9,42.93 | LED28.C 69.72,42.83 69.72,42.93 | LED27.C 64.74,42.93 | LED26.C 59.66,42.93 | LED25.C 54.48,42.83 54.48,42.93 | LED24.C 49.5,42.93 | LED23.C 44.42,42.93 | LED22.C 39.34,42.93 | LED21.C 34.16,42.83 34.16,42.93 | LED20.C 29.18,42.93 | LED19.C 24.1,42.93 | LED18.C 19.02,42.93 | LED17.C 13.94,42.93
ROW2
  Top 0.203: R3.2 87.07,36.97 87.07,25.97 82.39,21.29 73.87,21.29 73.67,21.09 U1.32
ROW2_SINK
  Top 0.203: LED31.C 8.86,39.12 13.94,39.12 | R3.1 83.22,39.12 79.98,39.12 | 13.94,39.12 19.02,39.12 | 19.02,39.12 24.1,39.12 | 24.1,39.12 29.18,39.12 | 29.18,39.12 34.26,39.12 | 34.26,39.12 39.34,39.12 | 39.34,39.12 44.42,39.12 | 44.42,39.12 49.5,39.12 | 49.5,39.12 54.58,39.12 | 54.58,39.12 59.66,39.12 | 59.66,39.12 64.74,39.12 | 64.74,39.12 69.82,39.12 | 69.82,39.12 74.9,39.12 | 74.9,39.12 79.98,39.12 | LED32.C 13.94,39.12 | LED33.C 19.02,39.12 | LED34.C 24.1,39.12 | LED35.C 29.18,39.12 | LED36.C 34.26,39.12 | LED37.C 39.34,39.12 | LED38.C 44.42,39.12 | LED39.C 49.5,39.12 | LED40.C 54.58,39.12 | LED41.C 59.66,39.12 | LED42.C 64.74,39.12 | LED43.C 69.82,39.12 | LED44.C 74.9,39.12 | LED45.C 79.98,39.12
ROW3
  Top 0.203: R4.2 86.72,33.51 86.72,26.12 82.24,21.65 71.63,21.65 U1.1
ROW3_SINK
  Top 0.203: R4.1 83.22,35.31 79.98,35.31 | LED46.C 8.86,35.31 13.94,35.31 | 79.98,35.31 74.9,35.31 | 74.9,35.31 69.82,35.31 | 69.82,35.31 64.74,35.31 | 64.74,35.31 59.66,35.31 | 59.66,35.31 54.58,35.31 | 54.58,35.31 49.4,35.31 | 49.4,35.31 44.42,35.31 | 44.42,35.31 39.34,35.31 | 39.34,35.31 34.26,35.31 | 34.26,35.31 29.08,35.31 | 29.08,35.31 24.1,35.31 | 24.1,35.31 19.02,35.31 | 19.02,35.31 13.94,35.31 | LED47.C 13.94,35.31 | LED48.C 19.02,35.31 | LED49.C 24.1,35.31 | LED50.C 28.16,34.38 29.08,35.31 | LED51.C 34.26,35.31 | LED52.C 39.34,35.31 | LED53.C 44.42,35.31 | LED54.C 49.4,35.21 49.4,35.31 | LED55.C 54.58,35.31 | LED56.C 59.66,35.31 | LED60.C 79.98,35.31 | LED59.C 74.9,35.31 | LED58.C 69.82,35.31 | LED57.C 64.74,35.31
ROW4
  Top 0.203: R5.2 86.36,30.06 86.36,26.29 82.08,22 71.85,22 71.27,22.58 71.27,23.44 71.09,23.62 70.39,23.62 69.94,23.17 U1.2
ROW4_SINK
  Top 0.203: LED61.C 8.86,31.5 13.94,31.5 | R5.1 83.22,31.5 79.98,31.5 | 13.94,31.5 19.02,31.5 | 19.02,31.5 24.1,31.5 | 24.1,31.5 29.18,31.5 | 29.18,31.5 34.26,31.5 | 34.26,31.5 39.34,31.5 | 39.34,31.5 44.42,31.5 | 44.42,31.5 49.5,31.5 | 49.5,31.5 54.58,31.5 | 54.58,31.5 59.66,31.5 | 59.66,31.5 64.74,31.5 | 64.74,31.5 69.82,31.5 | 69.82,31.5 74.9,31.5 | 74.9,31.5 79.98,31.5 | LED65.C 29.18,31.5 | LED64.C 24.1,31.5 | LED63.C 19.02,31.5 | LED62.C 13.94,31.5 | LED66.C 34.26,31.5 | LED67.C 39.34,31.5 | LED68.C 44.42,31.5 | LED69.C 49.5,31.5 | LED70.C 54.58,31.5 | LED71.C 59.66,31.5 | LED72.C 64.74,31.5 | LED73.C 69.82,31.5 | LED74.C 74.9,31.5 | LED75.C 79.98,31.5
SCL  (via drill 0.35)
  Top 0.203: IC1.6 54.61,15.37 v56.52,13.46 | v70.74,17.91 72.18,17.91 U1.28
  Bottom 0.203: v56.52,13.46 56.52,13.34 57.53,12.32 65.02,12.32 70.61,17.91 v70.74,17.91
SDA  (via drill 0.35)
  Top 0.203: IC1.5 54.87,14.1 v55.5,13.46 | v70.74,17 72.11,17 U1.27
  Bottom 0.203: v55.5,13.46 57,11.96 65.17,11.96 70.21,17 v70.74,17
VCC  (via drill 0.35)
  Top 0.203: C4.1 66.59,7.75 67.22,7.11 69.13,7.11 R15.1
  Top 0.305: IC1.8 55.51,17.91 56.6,16.82 58.38,16.82 61.21,13.98 61.21,13.08 63.5,10.79 C3.1
  Top 0.508: C3.1 65.94,11.44 U1.18 65.94,17.43 v67.44,18.92 | v68.71,20.95 68.71,21.21 68.34,21.57 U1.4
  Top 0.762: C3.1 C4.1
  Top 1.016: MASTERISP.2 53.72,8.64 53.72,6.99 55.88,4.83 | v61.47,4.83 55.88,4.83 | C4.1 65.41,8.26 v65.15,8 | 55.88,4.83 36.79,4.83 BT1.2-2 26.78,6.99 9.03,6.99 BT1.2
  Bottom 0.508: v68.71,20.95 68.71,20.19 v67.44,18.92
  Bottom 1.016: v61.47,4.83 61.98,4.83 v65.15,8

### Text on the board
bPlace: www.soldercreative.co.uk